# EAGLE design main (EAGLE 9.6.2)

## Sheet 1 of 2
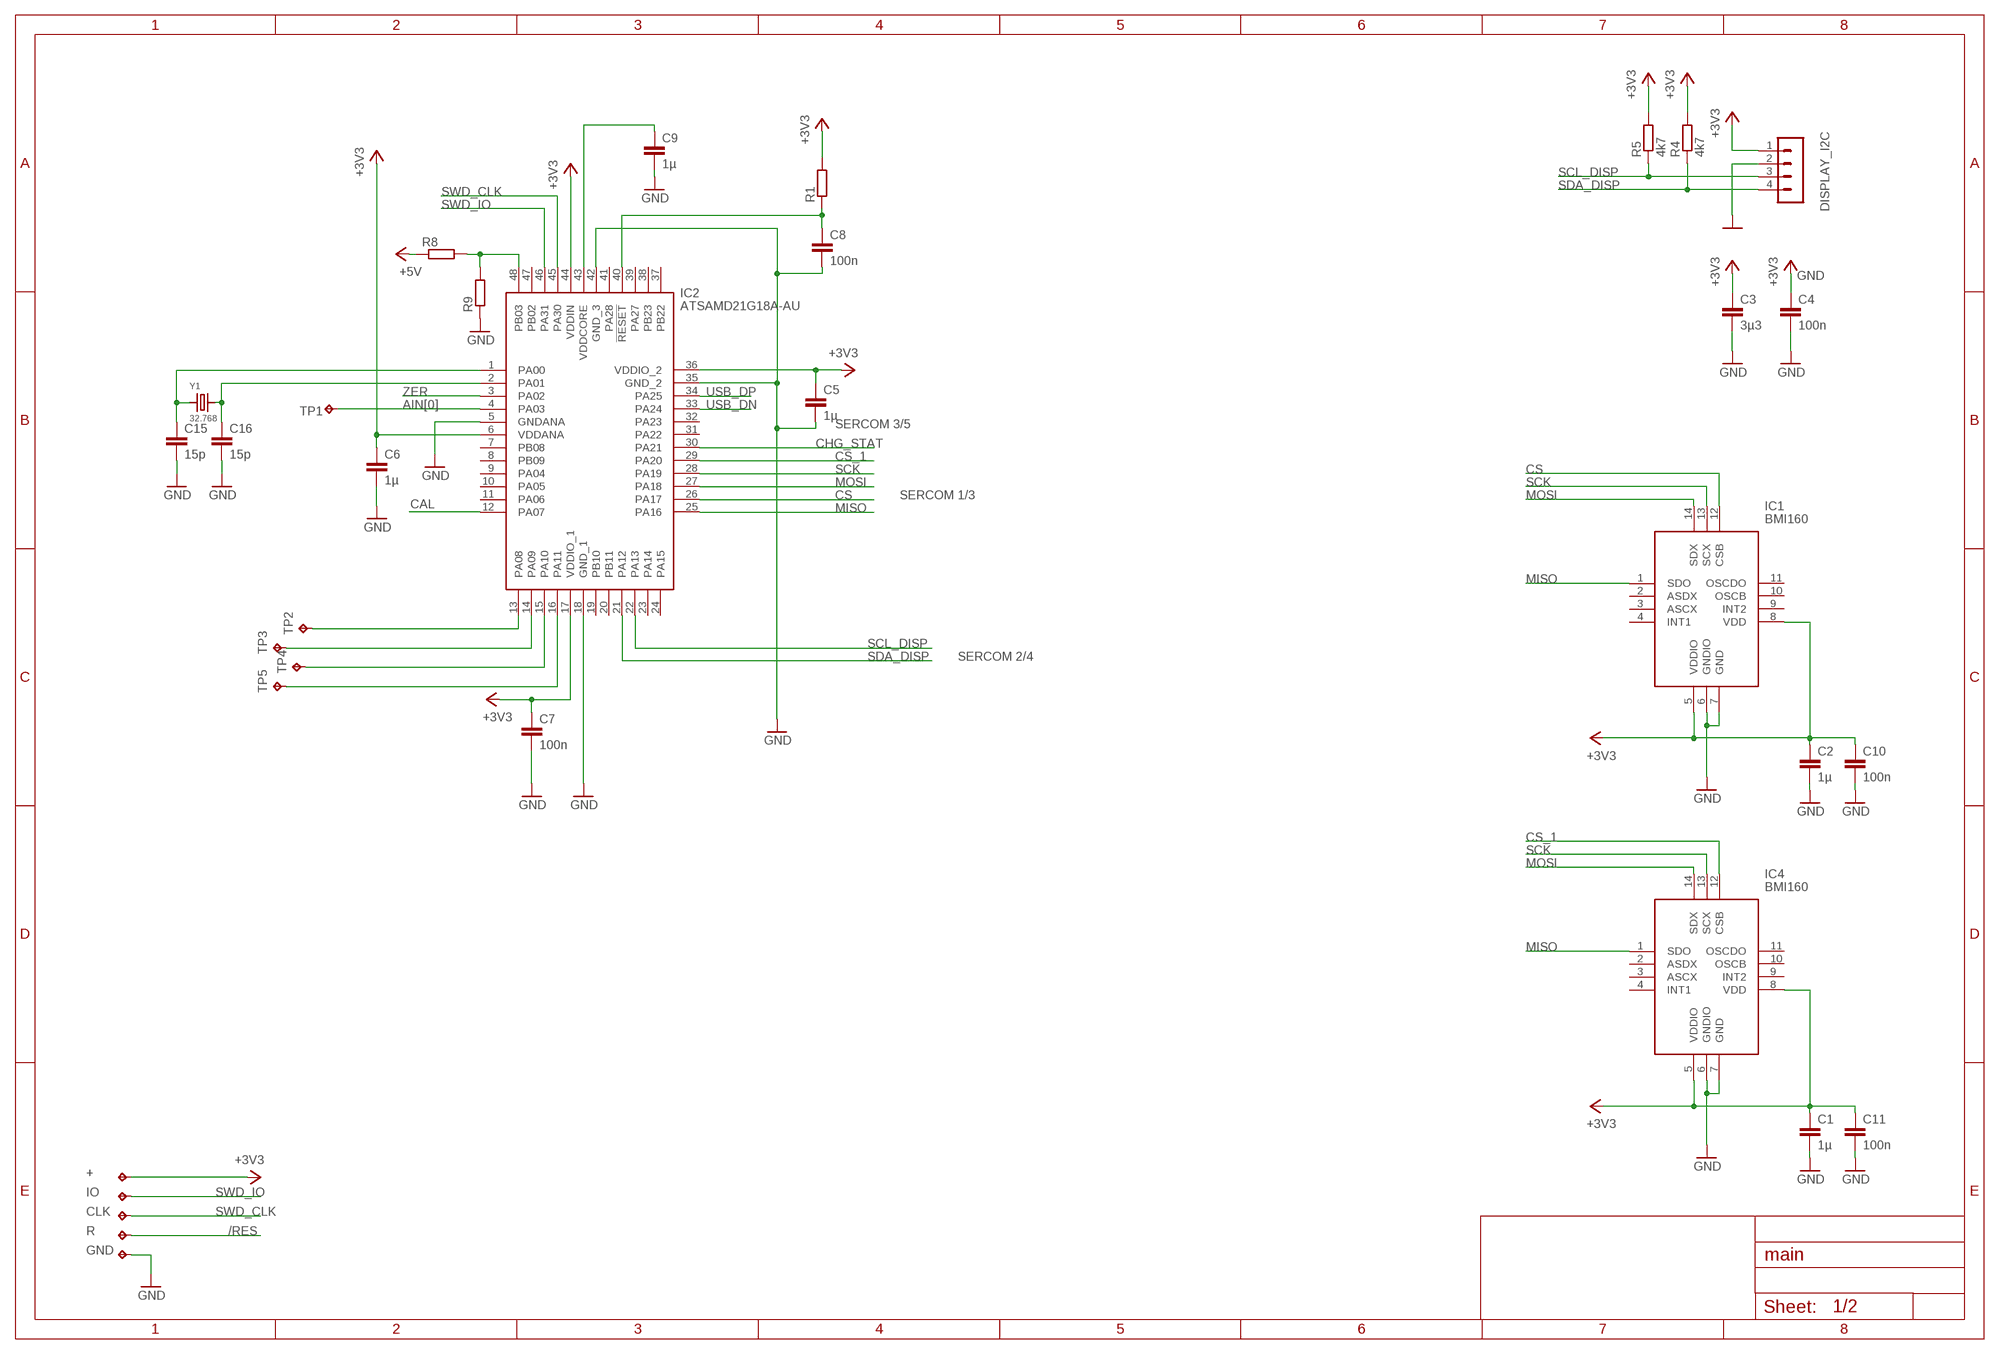
[diagram p0: schematic, sheet 1]

### Parts
+  TPB1,27  [B1,27]
C1  1µ  C-EUC0402K  [C0402K]
C2  1µ  C-EUC0402K  [C0402K]
C3  3µ3  C-EUC0402K  [C0402K]
C4  100n  C-EUC0402K  [C0402K]
C5  1µ  C-EUC0402K  [C0402K]
C6  1µ  C-EUC0402K  [C0402K]
C7  100n  C-EUC0402K  [C0402K]
C8  100n  C-EUC0402K  [C0402K]
C9  1µ  C-EUC0402K  [C0402K]
C10  100n  C-EUC0402K  [C0402K]
C11  100n  C-EUC0402K  [C0402K]
C15  15p  C-EUC0402  [C0402]
C16  15p  C-EUC0402  [C0402]
CLK  TPB1,27  [B1,27]
DISPLAY_I2C  MA04-1  [MA04-1]
GND  TPB1,27  [B1,27]
IC1  BMI160  [PQFN50P300X250X88-14N]
IC2  ATSAMD21G18A-AU  [QFP50P900X900X120-48N]
IC4  BMI160  [PQFN50P300X250X88-14N]
IO  TPB1,27  [B1,27]
R  TPB1,27  [B1,27]
R1  R-EU_R0402  [R0402]
R4  4k7  R-EU_R0402  [R0402]
R5  4k7  R-EU_R0402  [R0402]
R8  R-EU_R0402  [R0402]
R9  R-EU_R0402  [R0402]
TP1  TPB1,27  [B1,27]
TP2  TPB1,27  [B1,27]
TP3  TPB1,27  [B1,27]
TP4  TPB1,27  [B1,27]
TP5  TPB1,27  [B1,27]
Y1  32.768  CRYSTALTHIN32K  [CRYSTAL_4.9X1.8]

### Nets
+3V3: +.TP C1.1 C2.1 C3.1 C4.1 C5.1 C6.1 C7.1 C10.1 C11.1 DISPLAY_I2C.1 IC1.5(VDDIO) IC1.8(VDD) IC2.6(VDDANA) IC2.17(VDDIO_1) IC2.36(VDDIO_2) IC2.44(VDDIN) IC4.5(VDDIO) IC4.8(VDD) R1.2 R4.2 R5.2 ; also sheet 2
+5V: R8.1 ; also sheet 2
/RES: C8.1 IC2.40(!RESET) R1.1 R.TP
AIN[0]: IC2.4(PA03) TP1.TP
CAL: IC2.12(PA07) ; also sheet 2
CHG_STAT: IC2.30(PA21) ; also sheet 2
CS: IC1.12(CSB) IC2.26(PA17)
CS_1: IC2.29(PA20) IC4.12(CSB)
GND: C1.2 C2.2 C3.2 C4.2 C5.2 C6.2 C7.2 C8.2 C9.2 C10.2 C11.2 C15.2 C16.2 DISPLAY_I2C.2 GND.TP IC1.6(GNDIO) IC1.7(GND) IC2.5(GNDANA) IC2.18(GND_1) IC2.35(GND_2) IC2.42(GND_3) IC4.6(GNDIO) IC4.7(GND) R9.1 ; also sheet 2
MISO: IC1.1(SDO) IC2.25(PA16) IC4.1(SDO)
MOSI: IC1.14(SDX) IC2.27(PA18) IC4.14(SDX)
N$4: C9.1 IC2.43(VDDCORE)
N$5: IC2.13(PA08) TP2.TP
N$7: IC2.14(PA09) TP3.TP
N$8: IC2.15(PA10) TP4.TP
N$9: IC2.16(PA11) TP5.TP
N$10: IC2.48(PB03) R8.2 R9.2
N$11: C16.1 IC2.2(PA01) Y1.2
N$12: C15.1 IC2.1(PA00) Y1.1
SCK: IC1.13(SCX) IC2.28(PA19) IC4.13(SCX)
SCL_DISP: DISPLAY_I2C.3 IC2.22(PA13) R5.1
SDA_DISP: DISPLAY_I2C.4 IC2.21(PA12) R4.1
SWD_CLK: CLK.TP IC2.45(PA30)
SWD_IO: IC2.46(PA31) IO.TP
USB_DN: IC2.33(PA24) ; also sheet 2
USB_DP: IC2.34(PA25) ; also sheet 2
ZER: IC2.3(PA02) ; also sheet 2
Unconnected: IC1.2(ASDX) IC1.3(ASCX) IC1.4(INT1) IC1.9(INT2) IC1.10(OSCB) IC1.11(OSCDO) IC2.7(PB08) IC2.8(PB09) IC2.9(PA04) IC2.10(PA05) IC2.11(PA06) IC2.19(PB10) IC2.20(PB11) IC2.23(PA14) IC2.24(PA15) IC2.31(PA22) IC2.32(PA23) IC2.37(PB22) IC2.38(PB23) IC2.39(PA27) IC2.41(PA28) IC2.47(PB02) IC4.2(ASDX) IC4.3(ASCX) IC4.4(INT1) IC4.9(INT2) IC4.10(OSCB) IC4.11(OSCDO)

### Notes on the sheet
- SERCOM 3/5
- SERCOM 1/3
- SERCOM 2/4

## Sheet 2 of 2
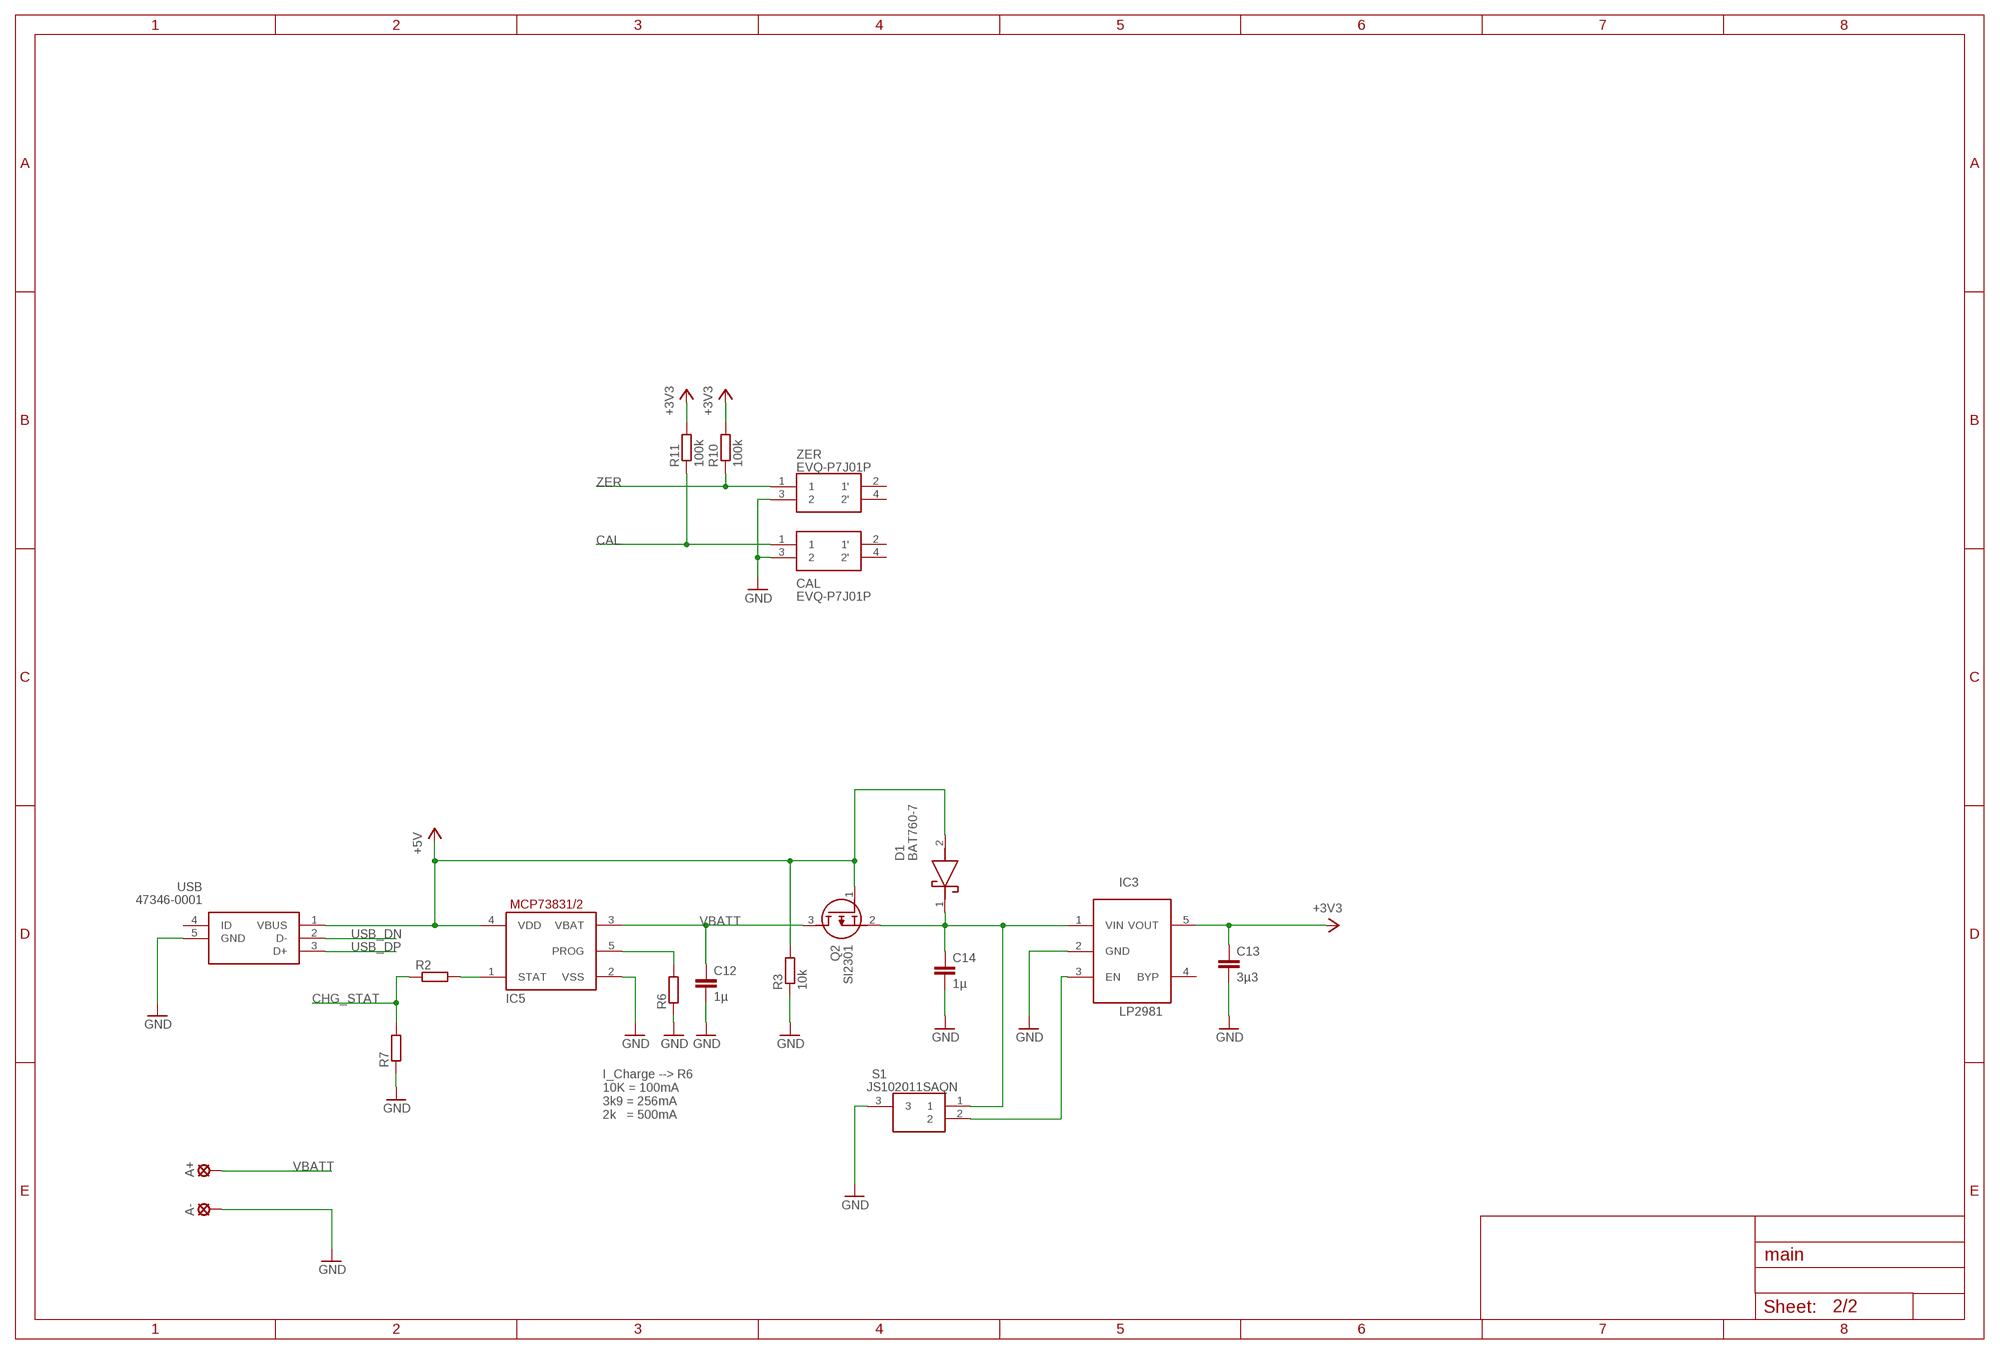
[diagram p1: schematic, sheet 2]

### Parts
A+  MCS08  [MCS08]
A-  MCS08  [MCS08]
C12  1µ  C-EUC0603  [C0603]
C13  3µ3  C-EUC0603  [C0603]
C14  1µ  C-EUC0603  [C0603]
CAL  EVQ-P7J01P  [EVQP7J01P]
D1  BAT760-7  [SOD2513X120N]
IC3  LP2981  LP298XS  [SOT23-5L]
IC5  MCP73831/OT  [SOT23-5L]
Q2  SI2301  [SOT95P240X120-3N]
R2  R-EU_R0402  [R0402]
R3  10k  R-EU_R0402  [R0402]
R6  R-EU_R0402  [R0402]
R7  R-EU_R0402  [R0402]
R10  100k  R-EU_R0402  [R0402]
R11  100k  R-EU_R0402  [R0402]
S1  JS102011SAQN  [JS102011SAQN]
USB  47346-0001  [47346-0001]
ZER  EVQ-P7J01P  [EVQP7J01P]

### Nets
+3V3: C13.1 IC3.5(VOUT) R10.2 R11.2 ; also sheet 1
+5V: D1.2(A) IC5.4(VDD) Q2.1(G) R3.2 USB.1(VBUS) ; also sheet 1
CAL: CAL.1 R11.1 ; also sheet 1
CHG_STAT: R2.1 R7.2 ; also sheet 1
GND: A-.MP C12.2 C13.2 C14.2 CAL.3 IC3.2(GND) IC5.2(VSS) R3.1 R6.1 R7.1 S1.3 USB.5(GND) ZER.3 ; also sheet 1
N$1: IC3.3(EN) S1.2
N$2: C14.1 D1.1(K) IC3.1(VIN) Q2.2(S) S1.1
N$3: IC5.1(STAT) R2.2
N$6: IC5.5(PROG) R6.2
USB_DN: USB.2(D-) ; also sheet 1
USB_DP: USB.3(D+) ; also sheet 1
VBATT: A+.MP C12.1 IC5.3(VBAT) Q2.3(D)
ZER: R10.1 ZER.1 ; also sheet 1
Unconnected: CAL.2(1') CAL.4(2') IC3.4(BYP) USB.4(ID) ZER.2(1') ZER.4(2')

### Notes on the sheet
- I_Charge --> R6
  10K = 100mA
  3k9 = 256mA
  2k   = 500mA

## Library data of the parts
+ CLK GND IO R TP1-TP5 = testpad:TP: Test pad
A+ A- = solpad:MCS08: SOLDER PAD MC S0,8, drill 1.2 mm, distributor Buerklin, 08F130
C1-C16 = rcl:C-EU: CAPACITOR, European symbol; SPICEPREFIX: C
CAL ZER = SamacSys_Parts:EVQ-P7J01P: Switch,Tactile,3.5x2.9mm,Light Touch Black Side Tactile Switch, SPST 50 mA@ 12 V dc 1.7mm Source: Datasheet <https://www3.panasonic.biz/ac/e_download/control/switch/light-touch/catalog/sw_lt_eng_3529s_side.pdf>; ARROW_PART_NUMBER: EVQ-P7J01P; ARROW_PRICE-STOCK: https://www.arrow.com/en/products/evq-p7j01p/panasonic; DESCRIPTION: Switch,Tactile,3.5x2.9mm,Light Touch Black Side Tactile Switch, SPST 50 mA@ 12 V dc 1.7mm; HEIGHT: 1mm; MANUFACTURER_NAME: Panasonic; MANUFACTURER_PART_NUMBER: EVQ-P7J01P; MOUSER_PART_NUMBER: 667-EVQP7J01P; MOUSER_PRICE-STOCK: https://www.mouser.co.uk/ProductDetail/Panasonic/EVQ-P7J01P?qs=rJ%252BziJWpyszkfuBTA00z9w%3D%3D
D1 = SamacSys_Parts:BAT760-7: Diode Schottky 30V 1A 2Pin SOD323 Diodes Inc BAT760-7, SMT Schottky Diode, 30V 1A, 2-Pin SOD-323 Source: Datasheet <https://www.diodes.com/assets/Datasheets/ds30498.pdf>; ARROW_PART_NUMBER: BAT760-7; ARROW_PRICE-STOCK: https://www.arrow.com/en/products/bat760-7/diodes-incorporated; DESCRIPTION: Diode Schottky 30V 1A 2Pin SOD323 Diodes Inc BAT760-7, SMT Schottky Diode, 30V 1A, 2-Pin SOD-323; HEIGHT: 1.2mm; MANUFACTURER_NAME: Diodes Inc.; MANUFACTURER_PART_NUMBER: BAT760-7; MOUSER_PART_NUMBER: 621-BAT760-7; MOUSER_PRICE-STOCK: https://www.mouser.co.uk/ProductDetail/Diodes-Incorporated/BAT760-7?qs=JV7lzlMm3yKDDyO09xoRbQ%3D%3D
DISPLAY_I2C = con-lstb:MA04-1: PIN HEADER; OC_FARNELL: unknown; OC_NEWARK: unknown
IC1 IC4 = SamacSys_Parts:BMI160: IMUs - Inertial Measurement Units 6-Axis 950uA Source: Datasheet <https://ae-bst.resource.bosch.com/media/products/dokumente/bmi160/BST-BMI160-DS000-07.pdf>; DESCRIPTION: IMUs - Inertial Measurement Units 6-Axis 950uA; HEIGHT: 0.88mm; MANUFACTURER_NAME: Bosch Sensortec; MANUFACTURER_PART_NUMBER: BMI160; MOUSER_PART_NUMBER: 262-BMI160; MOUSER_PRICE-STOCK: https://www.mouser.co.uk/ProductDetail/Bosch-Sensortec/BMI160?qs=Lj1LZLjqIN1DEsUDgjehlg%3D%3D
IC2 = SamacSys_Parts:ATSAMD21G18A-AU: ATMEL - ATSAMD21G18A-AU - MCU, 32BIT, CORTEX-M0+, 48MHZ, TQFP-48 Source: Datasheet <http://www.farnell.com/datasheets/1807566.pdf>; DESCRIPTION: ATMEL - ATSAMD21G18A-AU - MCU, 32BIT, CORTEX-M0+, 48MHZ, TQFP-48; HEIGHT: 1.2mm; MANUFACTURER_NAME: Microchip; MANUFACTURER_PART_NUMBER: ATSAMD21G18A-AU; MOUSER_PART_NUMBER: 556-ATSAMD21G18A-AU; MOUSER_PRICE-STOCK: https://www.mouser.co.uk/ProductDetail/Microchip-Technology/ATSAMD21G18A-AU?qs=KLFHFgXTQiDh1vL0VLU76Q%3D%3D; RS_PART_NUMBER: 1773799P; RS_PRICE-STOCK: http://uk.rs-online.com/web/p/products/1773799P
IC3 = adafruit:LP298X
IC5 = adafruit:MCP73831: MCP73831/2 Miniature Single-Cell, Fully Integrated Li-Ion, Li-Polymer Charge Management Controllers. Nice and small simple lipoly charge controller, with adjustable current and status output (LED) http://www.ladyada.net/library/pcb/eaglelibrary.html
Q2 = SamacSys_Parts:SI2301: MOSFET P Trench 20V 3A 1V @ 250uA 110 m @ 3A,4.5V SOT23 RoHS Source: Datasheet <https://datasheet.lcsc.com/szlcsc/1901091236_PUOLOP-SI2301_C351397.pdf>; ARROW_PART_NUMBER: SI2301; DESCRIPTION: MOSFET P Trench 20V 3A 1V @ 250uA 110 m @ 3A,4.5V SOT23 RoHS; HEIGHT: 1.2mm; MANUFACTURER_NAME: PUOLOP; MANUFACTURER_PART_NUMBER: SI2301
R1-R11 = rcl:R-EU_: RESISTOR, European symbol; SPICEPREFIX: R
S1 = SamacSys_Parts:JS102011SAQN: C & K COMPONENTS - JS102011SAQN - SWITCH, SPDT, 0.6A, 6VDC, SIDE, SMD Source: Datasheet <http://www.ckswitches.com/media/1422/js.pdf>; ARROW_PART_NUMBER: JS102011SAQN; ARROW_PRICE-STOCK: https://www.arrow.com/en/products/js102011saqn/ck; DESCRIPTION: C & K COMPONENTS - JS102011SAQN - SWITCH, SPDT, 0.6A, 6VDC, SIDE, SMD; HEIGHT: mm; MANUFACTURER_NAME: C & K COMPONENTS; MANUFACTURER_PART_NUMBER: JS102011SAQN; MOUSER_PART_NUMBER: 611-JS102011SAQN; MOUSER_PRICE-STOCK: https://www.mouser.co.uk/ProductDetail/CK/JS102011SAQN?qs=LgMIjt8LuD%252B69bNM9a%2FozQ%3D%3D
USB = SamacSys_Parts:47346-0001: Micro USB B Receptacle Bottom Mount Assy Molex Right Angle SMT Type B Version 2.0 Micro USB Connector Socket, 30 V ac, 1A 47352 MICRO-USB Source: Datasheet <http://www.molex.com/pdm_docs/sd/473460001_sd.pdf>; ARROW_PART_NUMBER: 47346-0001; DESCRIPTION: Micro USB B Receptacle Bottom Mount Assy Molex Right Angle SMT Type B Version 2.0 Micro USB Connector Socket, 30 V ac, 1A 47352 MICRO-USB; HEIGHT: mm; MANUFACTURER_NAME: Molex; MANUFACTURER_PART_NUMBER: 47346-0001; MOUSER_PART_NUMBER: 538-47346-0001; MOUSER_PRICE-STOCK: https://www.mouser.co.uk/ProductDetail/Molex/47346-0001?qs=c2CV6XM0DweJBWaSeyWeCw%3D%3D
Y1 = microbuilder:CRYSTAL: Crystals HC49UP - Surface Mount Crystal 4.0MHz 18pF +/-30ppm Surface Mount Crystal [Digikey: 535-9857-1-ND] 12.0 MHz Surface Mount Crystal [Digikey: 535-9869-6-ND] 25.0 MHz Surface Mount Crystal [Digikey: 535-9078-1-ND] 2.5 x 2.0mm - MEMs SMT Crystal 16.0 MHz 10pF 20ppm 2.5 x 2.0mm Crystal [Digikey -40-85°C: 535-10923-1-ND] 3.2 x 2.5mm - MEMs SMT Crystal 12.0 MHz 8pF 15ppm 3.2 x 2.5mm Crystal [Digikey: -10-70°C: 644-1047-1-ND -40-125°C: 644-1128-1-ND] 16.0 MHz 8pF 15ppm 3.2 x 2.5mm Crystal [Digikey: -10-70°C: 644-1049-1-ND -40-125°C: 644-1129-2-ND] 16.0 MHz 10pF 10ppm 3.2 x 2.5mm Crystal [Digikey: 644-1100-1-ND] 27.12 MHz 18pF 30ppm 3.2 x 2.5mm Crystal [Digikey: 887-1424-1-ND] 27.12MHz 10pF 10ppm 3.2 x 2.5mm Crystal [Digikey: 887-1329-1-ND] 4.9 x 1.8mm - MEMs SMT Crystal 32.768 KHz 12.5pF 20ppm 4.9 x 1.8mm Crystal [Digikey: SE2415CT-ND] 8.0 x 3.8mm - Surface Mount Crystal 32.768kHz 12.5pF 20ppm -40°C-85°C [Digikey: 535-9166-2-ND] Cylinder 32.768KHz Cylinder Crystal (2x6mm body) [Ex. Digikey: 300-8341-2-ND]

## Board
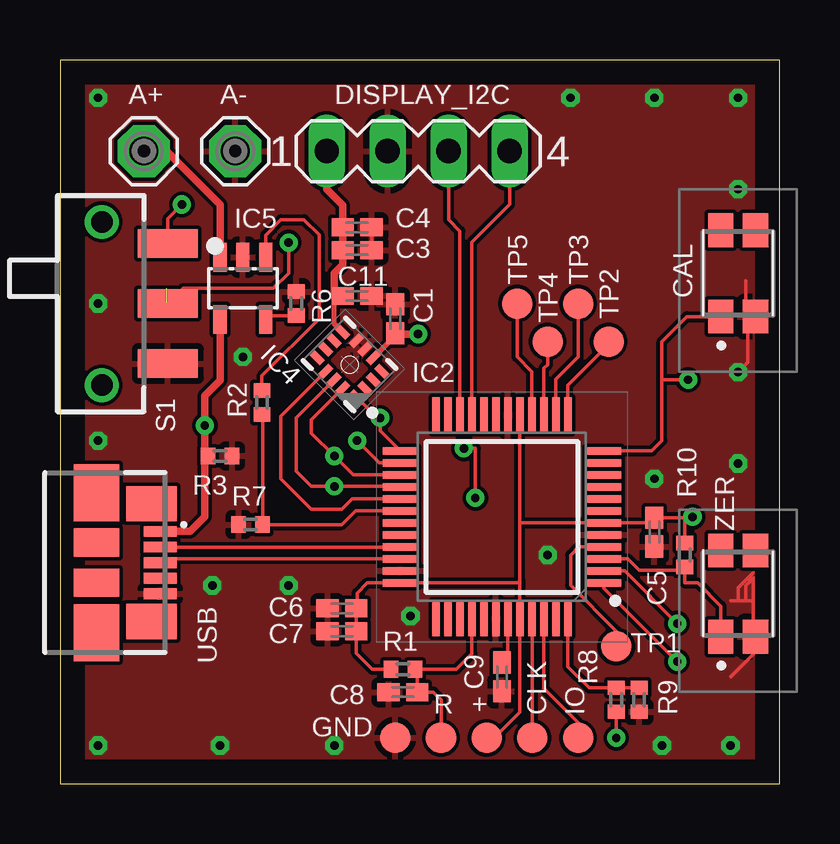
[diagram p2: board, top side]
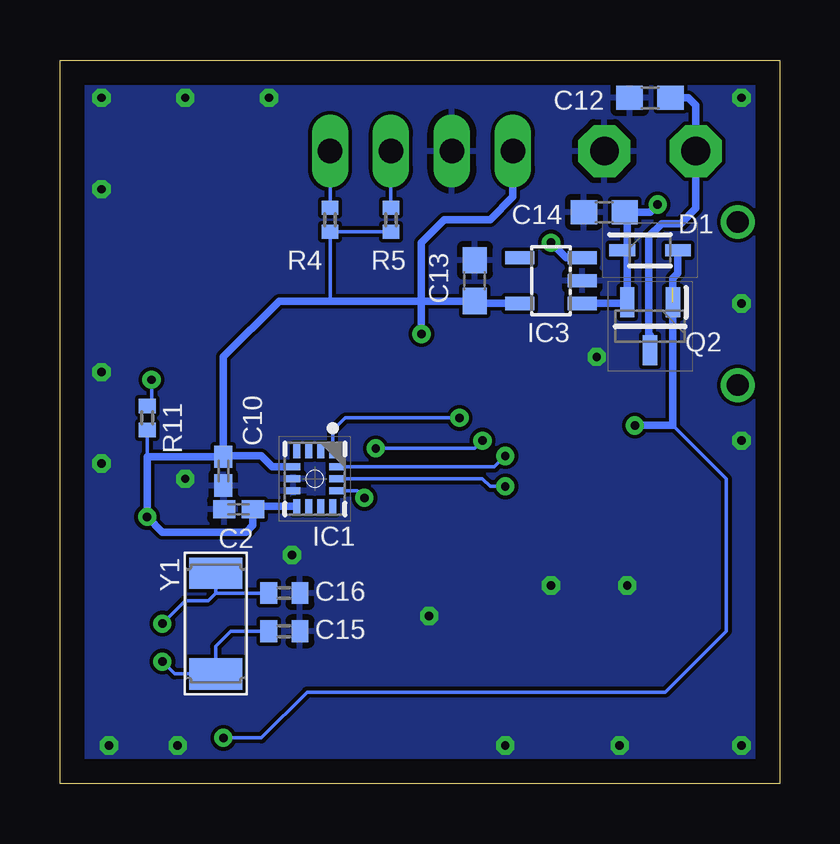
[diagram p3: board, bottom side, seen from below]

Size 29.98 x 30.15 mm. Coordinates in mm from the lower left corner, seen from the top.
Outline: 0,0 29.98,0 29.98,30.15 0,30.15 0,0
Copper layers (1*16): Top 0.035mm / dielectric 1.5mm / Bottom 0.035mm
Design rules "default": minimum track width 6mil, minimum drill 0.35mm, track to track 6mil, track to pad 6mil, pad to pad 6mil, via to via 6mil, smd to smd 6mil, copper to edge 40mil, drill to drill 6mil, minimum pad ring 10mil, minimum via ring 8mil, stop-mask expansion 4mil, vias tented up to drill 0mil, thermal gap 10mil

### Footprints (pad centres in the part's own frame; a part is rotated, then mirrored left to right if it is on the bottom)
B1,27 = smd 1.27 x 1.27: TP 0,0
MCS08 = drill 1.194 pad 2.159 octagon: MP 0,0
C0402K = smd 0.925 x 0.74: 1 -0.6,0; 2 0.6,0
C0603 = smd 1.1 x 1: 1 -0.85,0; 2 0.85,0
C0402 = smd 0.7 x 0.9: 1 -0.65,0; 2 0.65,0
EVQP7J01P = smd 1.4 x 1.05: 1 -1.5,0.725; 2 2.1,0.725; 3 -1.5,-0.725; 4 2.1,-0.725
SOD2513X120N = smd 1.075 x 0.5: 1 -1.162,0; 2 1.162,0
MA04-1 = drill 1.016 long: 1 -3.81,0; 2 -1.27,0; 3 1.27,0; 4 3.81,0
PQFN50P300X250X88-14N = smd 0.6 x 0.3: 1 -1.15,0.75; 2 -1.15,0.25; 3 -1.15,-0.25; 4 -1.15,-0.75; 8 1.15,-0.75; 9 1.15,-0.25; 10 1.15,0.25; 11 1.15,0.75 | smd 0.3 x 0.6: 5 -0.5,-0.9; 6 0,-0.9; 7 0.5,-0.9; 12 0.5,0.9; 13 0,0.9; 14 -0.5,0.9
QFP50P900X900X120-48N = smd 1.475 x 0.3: 1 -4.238,2.75; 2 -4.238,2.25; 3 -4.238,1.75; 4 -4.238,1.25; 5 -4.238,0.75; 6 -4.238,0.25; 7 -4.238,-0.25; 8 -4.238,-0.75; 9 -4.238,-1.25; 10 -4.238,-1.75; 11 -4.238,-2.25; 12 -4.238,-2.75; 25 4.238,-2.75; 26 4.238,-2.25; 27 4.238,-1.75; 28 4.238,-1.25; 29 4.238,-0.75; 30 4.238,-0.25; 31 4.238,0.25; 32 4.238,0.75; 33 4.238,1.25; 34 4.238,1.75; 35 4.238,2.25; 36 4.238,2.75 | smd 0.3 x 1.475: 13 -2.75,-4.238; 14 -2.25,-4.238; 15 -1.75,-4.238; 16 -1.25,-4.238; 17 -0.75,-4.238; 18 -0.25,-4.238; 19 0.25,-4.238; 20 0.75,-4.238; 21 1.25,-4.238; 22 1.75,-4.238; 23 2.25,-4.238; 24 2.75,-4.238; 37 2.75,4.238; 38 2.25,4.238; 39 1.75,4.238; 40 1.25,4.238; 41 0.75,4.238; 42 0.25,4.238; 43 -0.25,4.238; 44 -0.75,4.238; 45 -1.25,4.238; 46 -1.75,4.238; 47 -2.25,4.238; 48 -2.75,4.238
SOT23-5L = smd 0.55 x 1.2: 1 -0.95,-1.3; 2 0,-1.3; 3 0.95,-1.3; 4 0.95,1.3; 5 -0.95,1.3
SOT95P240X120-3N = smd 1.25 x 0.6: 1 -1,0.95; 2 -1,-0.95; 3 1,0
R0402 = smd 0.6 x 0.7: 1 -0.5,0; 2 0.5,0
JS102011SAQN = smd 1.2 x 2.5: 1 -2.5,1; 2 0,1; 3 2.5,1 | drill 0.9 pad 1.4: 4 -3.4,-1.75; 5 3.4,-1.75
47346-0001 = smd 0.45 x 1.38: 1 1.3,-4.81; 2 0.65,-4.81; 3 0,-4.81; 4 -0.65,-4.81; 5 -1.3,-4.81 | smd 1.475 x 2.1: 6 -2.453,-4.45; 7 2.453,-4.45 | smd 1.175 x 1.9: 8 0.838,-2.15; 9 -0.838,-2.15 | smd 2.375 x 1.9: 10 2.913,-2.15; 11 -2.913,-2.15
CRYSTAL_4.9X1.8 = smd 1.3 x 2.2: 1 -2.1,0; 2 2.1,0

### Placement (x,y rotation side)
+  17.78,1.91 0 top
A+  3.49,26.35 0 top
A-  7.3,26.35 0 top
C1  13.97,19.37 90 top
C2  22.54,11.43 180 bottom
C3  12.38,22.23 0 top
C4  12.38,23.18 0 top
C5  24.77,10.48 270 top
C6  11.75,7.3 180 top
C7  11.75,6.35 180 top
C8  14.29,3.81 180 top
C9  18.41,4.45 270 top
C10  23.18,13.02 270 bottom
C11  12.38,20.32 0 top
C12  5.4,28.57 180 bottom
C13  12.7,20.95 90 bottom
C14  7.3,23.81 180 bottom
C15  20.64,6.35 0 bottom
C16  20.64,7.94 0 bottom
CAL  28.26,20.95 90 top
CLK  19.68,1.91 0 top
D1  5.4,22.23 0 bottom
DISPLAY_I2C  14.92,26.35 0 top
GND  13.97,1.91 0 top
IC1  19.37,12.7 270 bottom
IC2  18.41,11.11 180 top
IC3  9.53,20.95 90 bottom
IC4  12.06,17.46 135 top
IC5  7.62,20.64 180 top
IO  21.59,1.91 0 top
Q2  5.4,19.05 270 bottom
R  15.88,1.91 0 top
R1  14.29,4.76 180 top
R2  8.41,15.88 90 top
R3  6.67,13.65 180 top
R4  18.73,23.5 270 bottom
R5  16.19,23.5 270 bottom
R6  9.84,20 270 top
R7  7.94,10.79 0 top
R8  23.18,3.49 90 top
R9  24.13,3.49 90 top
R10  26.04,9.53 90 top
R11  26.35,15.24 270 bottom
S1  3.49,20 270 top
TP1  23.18,5.71 180 top
TP2  22.86,18.41 0 top
TP3  21.59,20 0 top
TP4  20.32,18.41 0 top
TP5  19.05,20 0 top
USB  -0.64,9.21 90 top
Y1  23.5,6.67 90 bottom
ZER  28.26,7.62 90 top

### Tracks (layer width: path | path; a pad name or v marks a point on that pad's centre or on a via)
+3V3  (via drill 0.35 pad 0.55)
  Top 0.152: C6.1 12.38,7.27 | +.TP 18.1,1.91 19.16,2.97 IC2.44 19.16,8.46 | 19.16,8.46 19.07,8.36 IC2.36 12.81,8.36 12.38,7.94 12.38,7.34 C6.1 | 19.16,8.46 19.16,10.86 | 19.16,10.86 IC2.6 24.55,10.86 C5.1 26.32,11.08 v26.35,11.11 26.04,11.11 R10.2 | 19.16,10.86 IC2.17 | C6.1 C7.1 12.35,5.43 13.02,4.76 R1.2 | IC4.5 14.04,18.73
  Top 0.2: IC4.5 13.97,18.66 C1.1 | IC4.8 11.43,19.16 11.43,19.97 | 11.43,19.97 C11.1 | 11.43,19.97 11.43,20.29
  Top 0.305: DISPLAY_I2C.1 11.11,24.77 11.78,24.09 C4.1 C3.1 11.78,21.62 11.43,21.27 11.43,20.29 | 14.04,18.73 v14.92,18.73
  Bottom 0.152: 20.12,11.43 IC1.8 | C13.1 12.6,20 | 21.82,11.55 C2.1 | 23.14,13.65 C10.1 | 18.73,20.11 R4.2 R5.2 | R11.2 v26.35,11.11
  Bottom 0.305: 12.6,20 IC3.5 | IC1.8 21.82,11.55 | IC1.5 21.14,13.2 21.59,13.65 23.14,13.65 | C2.1 21.94,10.76 22.23,10.48 25.72,10.48 v26.35,11.11 26.35,13.62 C10.1 23.18,17.78 20.85,20.11 18.73,20.11 14.92,20.11 | 14.92,20.11 C13.1 | DISPLAY_I2C.1 11.11,24.45 12.06,23.5 13.97,23.5 14.92,22.54 14.92,20.11 | v14.92,18.73 14.92,20.11
+5V  (via drill 0.35 pad 0.55)  (1 unrouted)
  Top 0.152: 6.57,19.23 IC5.4 | v23.18,1.91 R8.1 | R3.2 6.03,13.65
  Top 0.305: USB.1 5.43,10.51 6.03,11.11 6.03,13.65 v6.03,14.92 6.03,16.16 6.67,16.8 IC5.4
  Bottom 0.152: v6.03,14.92 4.52,14.92 | Q2.1 | 4.45,14.92 2.22,12.7 2.22,6.35 4.76,3.81 19.68,3.81 21.59,1.91 v23.18,1.91
  Bottom 0.305: D1.2 4.24,21.27 4.45,21.06 4.45,20.64 | v6.03,14.92 4.45,14.92 Q2.1
/RES
  Top 0.152: 15.84,1.94 R.TP 15.88,3.49 15.56,3.81 C8.1 14.89,4.66 R1.1 16.51,4.76 17.16,5.42 IC2.40
AIN[0]
  Top 0.152: TP1.TP 23.18,6.35 21.27,8.26 21.27,9.53 21.61,9.86 IC2.4
CAL  (via drill 0.35 pad 0.55)
  Top 0.152: IC2.12 24.66,13.86 25.08,14.29 25.08,16.83 | 25.08,16.83 25.08,18.41 26.12,19.45 CAL.1 | v26.17,16.83 25.08,16.83
  Bottom 0.152: R11.1 26.17,15.92 v26.17,16.83
CHG_STAT
  Top 0.152: IC2.30 12.31,11.36 11.75,10.79 R7.2 8.44,15.35 R2.1
CS  (via drill 0.35 pad 0.55)
  Top 0.152: v17.3,11.91 17.3,13.97 v16.83,13.97 | v12.38,14.29 13.31,13.36 IC2.26
  Bottom 0.152: IC1.12 17.6,12.2 v17.3,11.91 | v16.83,13.97 12.7,13.97 v12.38,14.29
CS_1
  Top 0.152: IC4.12 9.21,15.31 9.21,12.7 10.48,11.43 11.75,11.43 12.18,11.86 IC2.29
GND  (via drill 0.35)
  Top 0.152: 24.6,10.04 C5.2 | C4.2 C3.2 | 27.94,4.45 28.98,5.49 ZER.3 28.89,6.21 28.89,7.62 | 28.89,7.62 28.57,7.62 | 28.57,7.62 28.26,7.62 | 28.26,7.62 27.94,7.62 | v28.26,17.14 28.66,17.55 28.66,19.05 28.98,19.37 CAL.3 28.57,19.86 28.57,20.95 | 28.89,7.62 28.89,8.57 28.73,8.41 | 28.73,8.41 28.57,8.26 28.57,7.62 | 28.26,7.62 28.26,8.16 28.73,8.63 | 28.73,8.41 28.73,8.63 | 28.73,8.63 28.89,8.79
  Bottom 0.152: C10.2 22.89,12.7
  other vias: 1.59,14.29 1.59,1.59 6.67,1.59 25.08,1.59 27.94,1.59 28.26,13.34 21.27,28.57 28.26,28.57 11.43,1.59 14.61,6.99 24.77,12.7 28.26,24.77 24.77,28.57 7.62,17.78 20.32,9.53 1.59,20 1.59,28.57 6.35,8.26 9.53,8.26
  pour Bottom: 0,30.16 0,0 30.16,0 30.16,30.16
  pour Top: 0,30.16 30.16,30.16 30.16,-0.32 0,-0.32
MISO  (via drill 0.35 pad 0.55)
  Top 0.152: IC2.25 13.34,14.7 13.34,15.13 13.23,15.24 | 12.46,16.12 IC4.1 13.23,15.24 | v13.34,15.24 13.23,15.24
  Bottom 0.152: IC1.1 18.62,14.72 18.1,15.24 v13.34,15.24
MOSI  (via drill 0.35 pad 0.55)
  Top 0.152: 14.16,12.88 IC2.27 12.22,12.86 v11.43,13.65 10.48,14.61 10.48,15.17 IC4.14
  Bottom 0.152: IC1.14 11.88,13.2 v11.43,13.65
N$1  (via drill 0.35 pad 0.55)
  Top 0.152: S1.2 5.13,20.64 8.89,20.64 9.53,21.27 v9.53,22.54
  Bottom 0.305: v9.53,22.54 8.89,21.91 IC3.3
N$2  (via drill 0.35 pad 0.55)
  Top 0.152: S1.1 4.49,23.54 v5.08,24.13
  Bottom 0.152: 6.39,20 Q2.2 | 6.35,22.22 6.35,22.23 D1.1 | 6.35,23.81 C14.1
  Bottom 0.305: IC3.1 6.39,20 | Q2.2 6.35,22.22 | 6.35,22.23 6.35,23.81 5.4,23.81 v5.08,24.13
N$3
  Top 0.152: 8.57,21.59 IC5.1 8.57,22.86 9.21,23.5 10.16,23.5 10.79,22.86 10.79,19.37 8.41,16.99 R2.2
N$4
  Top 0.152: 18.73,6.81 IC2.43 18.66,5.29 C9.1
N$5
  Top 0.152: IC2.13 21.16,16.61 22.86,18.3 TP2.TP
N$6
  Top 0.152: IC5.5 8.73,19.5 R6.2
N$7
  Top 0.152: IC2.14 20.66,16.86 21.59,17.78 TP3.TP
N$8
  Top 0.152: IC2.15 20.16,17.31 20.32,17.46 TP4.TP
N$9
  Top 0.152: TP5.TP 19.05,17.78 19.66,17.16 IC2.16
N$10
  Top 0.152: IC2.48 21.16,4.87 22.04,3.99 R8.2 | R8.2 23.11,3.99 | R9.2 R8.2
N$11  (via drill 0.35 pad 0.55)
  Top 0.152: IC2.2 23.52,8.86 v25.72,6.67
  Bottom 0.152: C16.1 23.5,7.94 | 23.5,8.26 Y1.2 23.5,7.94 | v25.72,6.67 24.77,7.62 23.81,7.62 23.5,7.94
N$12  (via drill 0.35 pad 0.55)
  Top 0.152: v25.72,5.08 22.65,8.14 IC2.1
  Bottom 0.152: C15.1 22.86,6.35 23.5,5.71 Y1.1 25.2,4.57 v25.72,5.08
SCK  (via drill 0.35 pad 0.55)
  Top 0.152: IC2.28 14.16,12.38 v11.43,12.38 10.48,12.38 9.84,13.02 9.84,15.24 IC4.13
  Bottom 0.152: IC1.13 12.38,12.7 12.06,12.38 v11.43,12.38
SCL_DISP
  Top 0.152: DISPLAY_I2C.3 16.19,23.5 16.66,23.02 IC2.22
  Bottom 0.152: DISPLAY_I2C.3 R5.1
SDA_DISP
  Top 0.152: DISPLAY_I2C.4 18.73,24.13 17.16,22.56 IC2.21
  Bottom 0.152: R4.1 DISPLAY_I2C.4
SWD_CLK
  Top 0.152: IC2.45 19.68,6.85 CLK.TP
SWD_IO
  Top 0.152: IC2.46 20.16,3.96 21.59,2.54 IO.TP
USB_DN
  Top 0.152: USB.2 IC2.33
USB_DP
  Top 0.152: IC2.34 4.33,9.36 USB.3
VBATT
  Top 0.305: IC5.3 6.67,24.13 4.45,26.35 A+.MP
  Bottom 0.305: Q2.3 5.4,18.68 5.45,18.73 5.45,22.81 4.92,23.34 4.13,23.34 3.49,23.97 A+.MP 3.49,28.26 3.81,28.57 C12.1
ZER
  Top 0.152: ZER.1 27.53,7.39 26.56,8.36 26.04,8.36 26.04,8.89 | R10.1 26.04,8.89 | IC2.3 23.66,9.36 24.13,8.89 26.04,8.89